# Altium schematic sheet Overview.SchDoc
size A4; Date: 2025-01-26; Engineer: Ganghyeok Lim; Revision: A; SheetNumber: 2; SheetTotal: 2
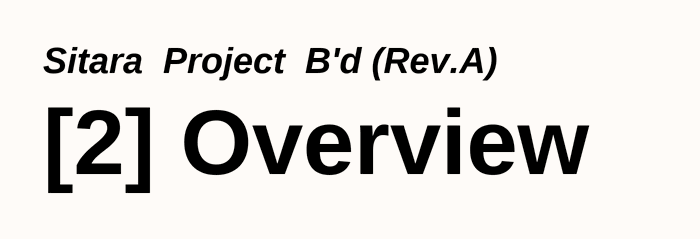
[diagram p0: Overview.SchDoc]

## Notes on the sheet
- Sitara  Project  B'd (Rev.A)
- [2] Overview
- Title
- Rev
- Doc
- Sheet #
- of
- Engineer
- This document is copyright of ArkX and shall not be revealed, produced, copied, in whole or in part,
- Date
- nor used for any purpose other than submitted.